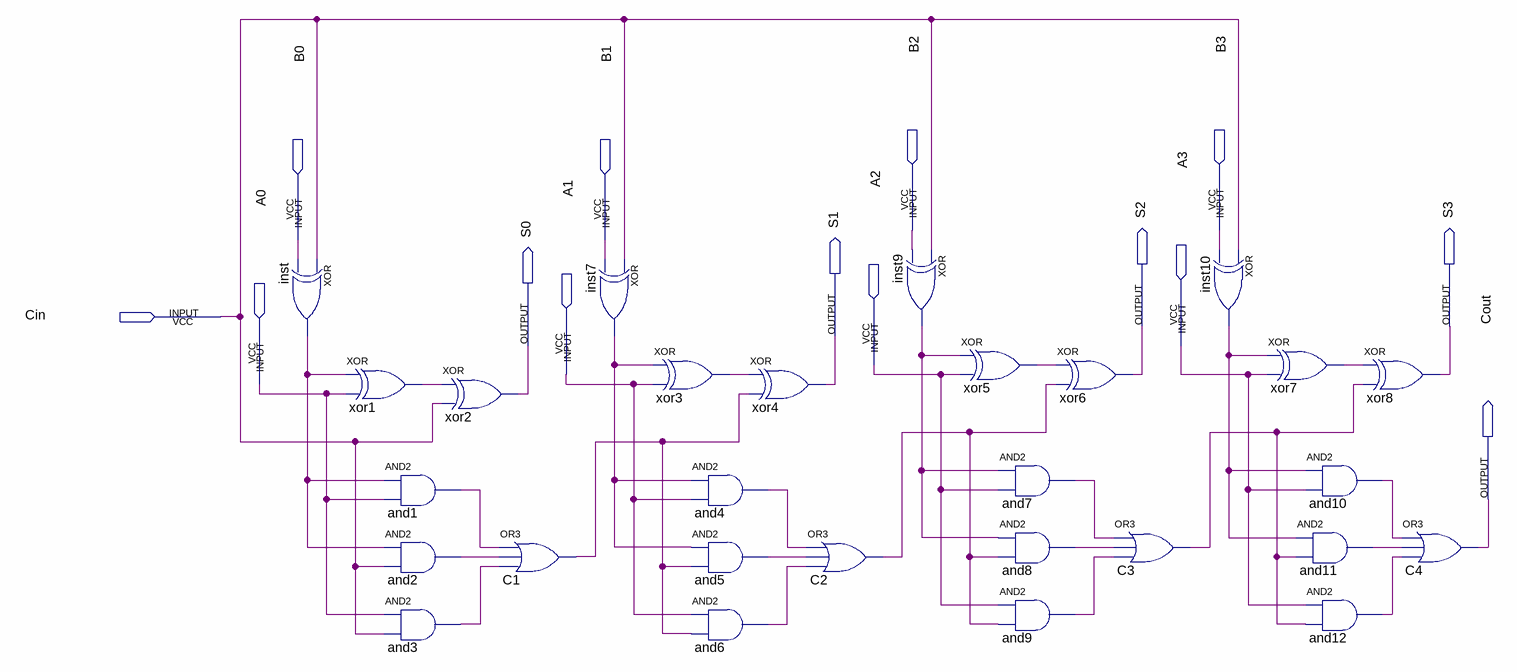
[diagram p0: schematic sheet]
// Quartus schematic Question2.bdf as structural Verilog: 28 symbols, 14 pins
module Question2 (
  input  B2,
  input  B3,
  input  B0,
  input  B1,
  input  Cin,
  input  A3,
  input  A2,
  input  A1,
  input  A0,
  output S2,
  output S3,
  output S1,
  output S0,
  output Cout
);

  wire and1_out, and2_out, and3_out, and4_out, and5_out, and6_out, and7_out, and8_out, and9_out, and10_out,
       and11_out, and12_out, C1_out, C2_out, C3_out, inst7_out, inst9_out, inst10_out, inst_out, xor1_out,
       xor3_out, xor5_out, xor7_out;

  xor inst (inst_out, Cin, B0);
  xor xor1 (xor1_out, inst_out, A0);
  and and1 (and1_out, inst_out, A0);
  and and2 (and2_out, inst_out, Cin);
  and and3 (and3_out, A0, Cin);
  xor xor2 (S0, xor1_out, Cin);
  or C1 (C1_out, and1_out, and2_out, and3_out);
  xor inst7 (inst7_out, Cin, B1);
  xor xor3 (xor3_out, inst7_out, A1);
  and and4 (and4_out, inst7_out, A1);
  and and5 (and5_out, inst7_out, C1_out);
  and and6 (and6_out, A1, C1_out);
  xor xor4 (S1, xor3_out, C1_out);
  or C2 (C2_out, and4_out, and5_out, and6_out);
  xor inst9 (inst9_out, Cin, B2);
  xor xor5 (xor5_out, inst9_out, A2);
  and and7 (and7_out, inst9_out, A2);
  and and8 (and8_out, inst9_out, C2_out);
  and and9 (and9_out, A2, C2_out);
  xor xor6 (S2, xor5_out, C2_out);
  or C3 (C3_out, and7_out, and8_out, and9_out);
  xor inst10 (inst10_out, Cin, B3);
  xor xor7 (xor7_out, inst10_out, A3);
  and and10 (and10_out, inst10_out, A3);
  and and11 (and11_out, inst10_out, C3_out);
  and and12 (and12_out, A3, C3_out);
  xor xor8 (S3, xor7_out, C3_out);
  or C4 (Cout, and10_out, and11_out, and12_out);
endmodule
